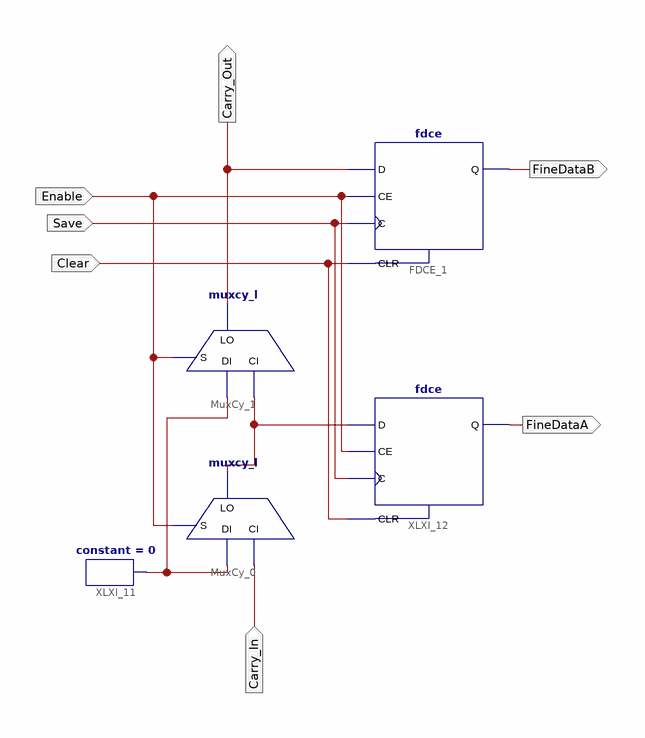
[diagram p0: schematic sheet 1]
// Xilinx ISE schematic TDCBasicCell.sch (virtex4) as structural Verilog: 5 symbols, 7 ports
module TDCBasicCell (
  input  Carry_In,
  input  Clear,
  input  Enable,
  input  Save,
  output FineDataB,
  output Carry_Out,
  output FineDataA
);

  wire Carry_On, Const_0;

  muxcy_l #(.RLOC("X0Y0")) MuxCy_0 (.CI(Carry_In), .DI(Const_0), .S(Enable), .LO(Carry_On));
  constant #(.CValue("0")) XLXI_11 (.O(Const_0));
  muxcy_l #(.RLOC("X0Y0")) MuxCy_1 (.CI(Carry_On), .DI(Const_0), .S(Enable), .LO(Carry_Out));
  fdce #(.RLOC("X0Y0")) FDCE_1 (.C(Save), .CE(Enable), .CLR(Clear), .D(Carry_Out), .Q(FineDataB));
  fdce #(.RLOC("X0Y0")) XLXI_12 (.C(Save), .CE(Enable), .CLR(Clear), .D(Carry_On), .Q(FineDataA));
endmodule
